# Altium schematic sheet MainADC.SchDoc
size A4
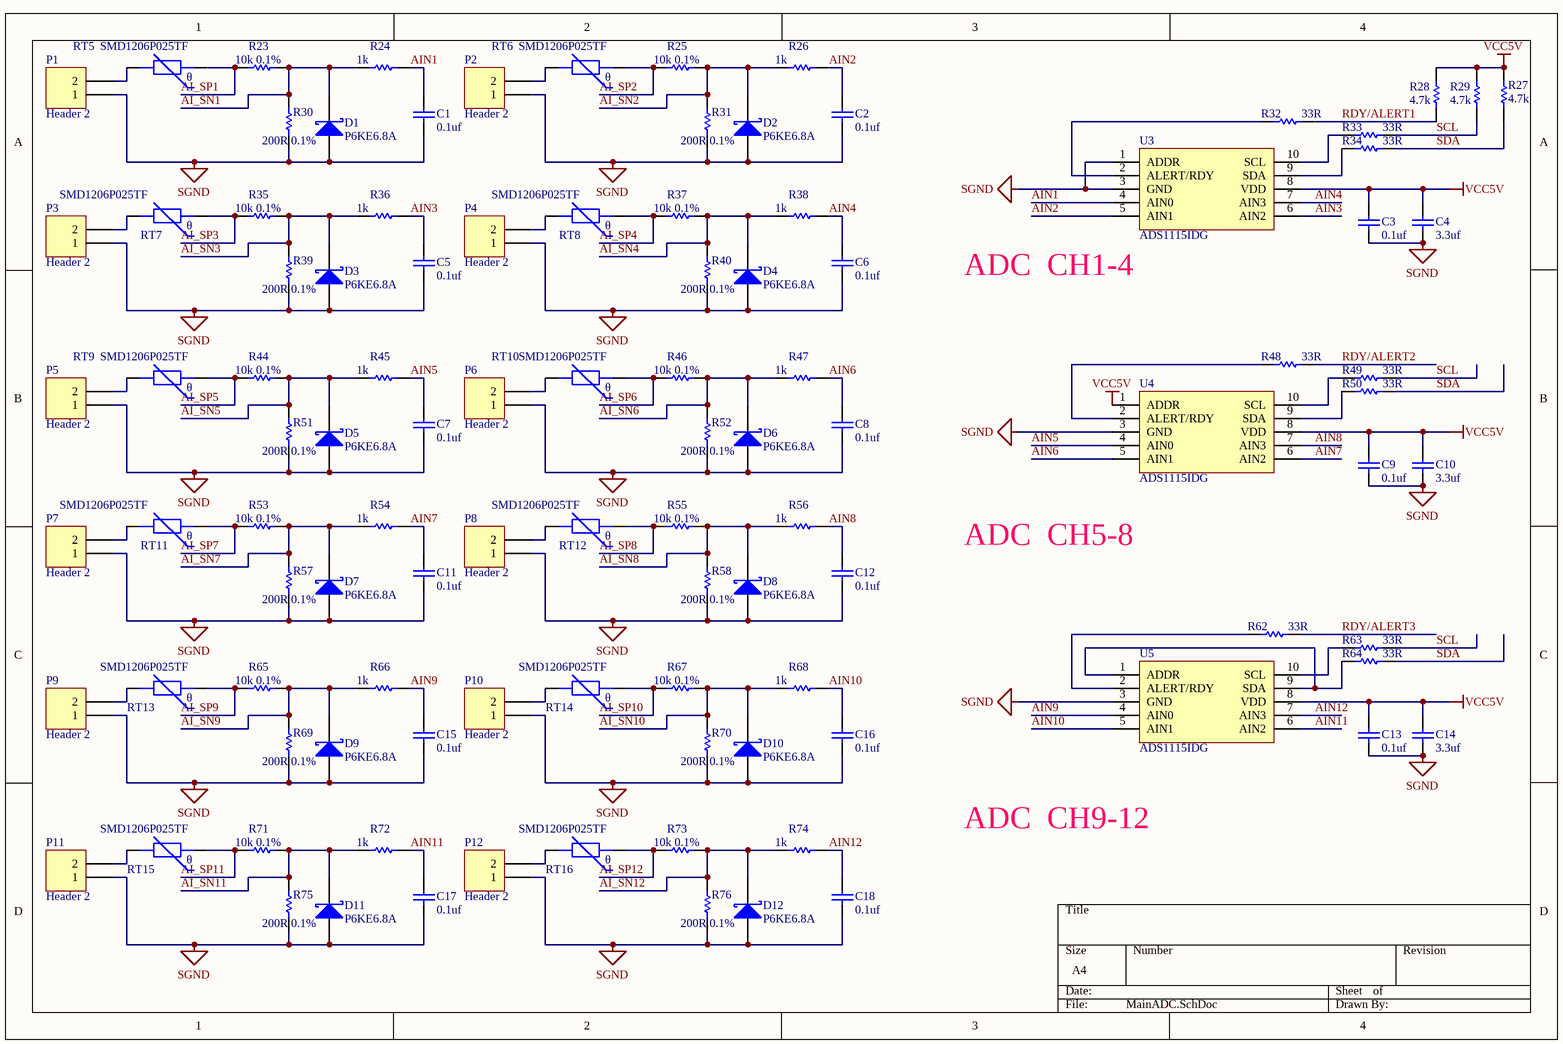
[diagram p0: MainADC.SchDoc]

## Parts
C1  value 0.1uf  [C0805]  (hidden comment: Cap)
C2  value 0.1uf  [C0805]  (hidden comment: Cap)
C3  value 0.1uf  [C0805]  (hidden comment: Cap)
C4  value 3.3uf  [C0805]  (hidden comment: Cap)
C5  value 0.1uf  [C0805]  (hidden comment: Cap)
C6  value 0.1uf  [C0805]  (hidden comment: Cap)
C7  value 0.1uf  [C0805]  (hidden comment: Cap)
C8  value 0.1uf  [C0805]  (hidden comment: Cap)
C9  value 0.1uf  [C0805]  (hidden comment: Cap)
C10  value 3.3uf  [C0805]  (hidden comment: Cap)
C11  value 0.1uf  [C0805]  (hidden comment: Cap)
C12  value 0.1uf  [C0805]  (hidden comment: Cap)
C13  value 0.1uf  [C0805]  (hidden comment: Cap)
C14  value 3.3uf  [C0805]  (hidden comment: Cap)
C15  value 0.1uf  [C0805]  (hidden comment: Cap)
C16  value 0.1uf  [C0805]  (hidden comment: Cap)
C17  value 0.1uf  [C0805]  (hidden comment: Cap)
C18  value 0.1uf  [C0805]  (hidden comment: Cap)
D1  P6KE6.8A  [SMB]
D2  P6KE6.8A  [SMB]
D3  P6KE6.8A  [SMB]
D4  P6KE6.8A  [SMB]
D5  P6KE6.8A  [SMB]
D6  P6KE6.8A  [SMB]
D7  P6KE6.8A  [SMB]
D8  P6KE6.8A  [SMB]
D9  P6KE6.8A  [SMB]
D10  P6KE6.8A  [SMB]
D11  P6KE6.8A  [SMB]
D12  P6KE6.8A  [SMB]
P1  Header 2  [JIEKE_2PX508]
P2  Header 2  [JIEKE_2PX508]
P3  Header 2  [JIEKE_2PX508]
P4  Header 2  [JIEKE_2PX508]
P5  Header 2  [JIEKE_2PX508]
P6  Header 2  [JIEKE_2PX508]
P7  Header 2  [JIEKE_2PX508]
P8  Header 2  [JIEKE_2PX508]
P9  Header 2  [JIEKE_2PX508]
P10  Header 2  [JIEKE_2PX508]
P11  Header 2  [JIEKE_2PX508]
P12  Header 2  [JIEKE_2PX508]
R23  value 10k 0.1%  [0805]  (hidden comment: Res Semi)
R24  value 1k  [0805]  (hidden comment: Res Semi)
R25  value 10k 0.1%  [0805]  (hidden comment: Res Semi)
R26  value 1k  [0805]  (hidden comment: Res Semi)
R27  value 4.7k  [0805]  (hidden comment: Res Semi)
R28  value 4.7k  [0805]  (hidden comment: Res Semi)
R29  value 4.7k  [0805]  (hidden comment: Res Semi)
R30  value 200R 0.1%  [0805]  (hidden comment: Res Semi)
R31  value 200R 0.1%  [0805]  (hidden comment: Res Semi)
R32  value 33R  [0805]  (hidden comment: Res Semi)
R33  value 33R  [0805]  (hidden comment: Res Semi)
R34  value 33R  [0805]  (hidden comment: Res Semi)
R35  value 10k 0.1%  [0805]  (hidden comment: Res Semi)
R36  value 1k  [0805]  (hidden comment: Res Semi)
R37  value 10k 0.1%  [0805]  (hidden comment: Res Semi)
R38  value 1k  [0805]  (hidden comment: Res Semi)
R39  value 200R 0.1%  [0805]  (hidden comment: Res Semi)
R40  value 200R 0.1%  [0805]  (hidden comment: Res Semi)
R44  value 10k 0.1%  [0805]  (hidden comment: Res Semi)
R45  value 1k  [0805]  (hidden comment: Res Semi)
R46  value 10k 0.1%  [0805]  (hidden comment: Res Semi)
R47  value 1k  [0805]  (hidden comment: Res Semi)
R48  value 33R  [0805]  (hidden comment: Res Semi)
R49  value 33R  [0805]  (hidden comment: Res Semi)
R50  value 33R  [0805]  (hidden comment: Res Semi)
R51  value 200R 0.1%  [0805]  (hidden comment: Res Semi)
R52  value 200R 0.1%  [0805]  (hidden comment: Res Semi)
R53  value 10k 0.1%  [0805]  (hidden comment: Res Semi)
R54  value 1k  [0805]  (hidden comment: Res Semi)
R55  value 10k 0.1%  [0805]  (hidden comment: Res Semi)
R56  value 1k  [0805]  (hidden comment: Res Semi)
R57  value 200R 0.1%  [0805]  (hidden comment: Res Semi)
R58  value 200R 0.1%  [0805]  (hidden comment: Res Semi)
R62  value 33R  [0805]  (hidden comment: Res Semi)
R63  value 33R  [0805]  (hidden comment: Res Semi)
R64  value 33R  [0805]  (hidden comment: Res Semi)
R65  value 10k 0.1%  [0805]  (hidden comment: Res Semi)
R66  value 1k  [0805]  (hidden comment: Res Semi)
R67  value 10k 0.1%  [0805]  (hidden comment: Res Semi)
R68  value 1k  [0805]  (hidden comment: Res Semi)
R69  value 200R 0.1%  [0805]  (hidden comment: Res Semi)
R70  value 200R 0.1%  [0805]  (hidden comment: Res Semi)
R71  value 10k 0.1%  [0805]  (hidden comment: Res Semi)
R72  value 1k  [0805]  (hidden comment: Res Semi)
R73  value 10k 0.1%  [0805]  (hidden comment: Res Semi)
R74  value 1k  [0805]  (hidden comment: Res Semi)
R75  value 200R 0.1%  [0805]  (hidden comment: Res Semi)
R76  value 200R 0.1%  [0805]  (hidden comment: Res Semi)
RT5  SMD1206P025TF  [1206]
RT6  SMD1206P025TF  [1206]
RT7  SMD1206P025TF  [1206]
RT8  SMD1206P025TF  [1206]
RT9  SMD1206P025TF  [1206]
RT10  SMD1206P025TF  [1206]
RT11  SMD1206P025TF  [1206]
RT12  SMD1206P025TF  [1206]
RT13  SMD1206P025TF  [1206]
RT14  SMD1206P025TF  [1206]
RT15  SMD1206P025TF  [1206]
RT16  SMD1206P025TF  [1206]
U3  ADS1115IDG  [10uSOP_M]
U4  ADS1115IDG  [10uSOP_M]
U5  ADS1115IDG  [10uSOP_M]

## Nets
SGND: C1.2 C2.2 C3.2 C4.2 C5.2 C6.2 C7.2 C8.2 C9.2 C10.2 C11.2 C12.2 C13.2 C14.2 C15.2 C16.2 C17.2 C18.2 D1.1(A) D2.1(A) D3.1(A) D4.1(A) D5.1(A) D6.1(A) D7.1(A) D8.1(A) D9.1(A) D10.1(A) D11.1(A) D12.1(A) P1.1 P2.1 P3.1 P4.1 P5.1 P6.1 P7.1 P8.1 P9.1 P10.1 P11.1 P12.1 R30.2 R31.2 R39.2 R40.2 R51.2 R52.2 R57.2 R58.2 R69.2 R70.2 R75.2 R76.2 U3.1(ADDR) U3.3(GND) U4.3(GND) U5.3(GND)
VCC5V: C3.1 C4.1 C9.1 C10.1 C13.1 C14.1 R27.1 R28.1 R29.1 U3.8(VDD) U4.1(ADDR) U4.8(VDD) U5.8(VDD)
AI_SN1: D1.2(K) R23.1 R24.2 R30.1
AI_SN2: D2.2(K) R25.1 R26.2 R31.1
AI_SN3: D3.2(K) R35.1 R36.2 R39.1
AI_SN4: D4.2(K) R37.1 R38.2 R40.1
AI_SN5: D5.2(K) R44.1 R45.2 R51.1
AI_SN6: D6.2(K) R46.1 R47.2 R52.1
AI_SN7: D7.2(K) R53.1 R54.2 R57.1
AI_SN8: D8.2(K) R55.1 R56.2 R58.1
AI_SN9: D9.2(K) R65.1 R66.2 R69.1
AI_SN10: D10.2(K) R67.1 R68.2 R70.1
AI_SN11: D11.2(K) R71.1 R72.2 R75.1
AI_SN12: D12.2(K) R73.1 R74.2 R76.1
AI_SP1: R23.2 RT5.2
AI_SP2: R25.2 RT6.2
AI_SP3: R35.2 RT7.2
AI_SP4: R37.2 RT8.2
AI_SP5: R44.2 RT9.2
AI_SP6: R46.2 RT10.2
AI_SP7: R53.2 RT11.2
AI_SP8: R55.2 RT12.2
AI_SP9: R65.2 RT13.2
AI_SP10: R67.2 RT14.2
AI_SP11: R71.2 RT15.2
AI_SP12: R73.2 RT16.2
AIN1: C1.1 R24.1 U3.4(AIN0)
AIN2: C2.1 R26.1 U3.5(AIN1)
AIN3: C5.1 R36.1 U3.6(AIN2)
AIN4: C6.1 R38.1 U3.7(AIN3)
AIN5: C7.1 R45.1 U4.4(AIN0)
AIN6: C8.1 R47.1 U4.5(AIN1)
AIN7: C11.1 R54.1 U4.6(AIN2)
AIN8: C12.1 R56.1 U4.7(AIN3)
AIN9: C15.1 R66.1 U5.4(AIN0)
AIN10: C16.1 R68.1 U5.5(AIN1)
AIN11: C17.1 R72.1 U5.6(AIN2)
AIN12: C18.1 R74.1 U5.7(AIN3)
RDY/ALERT1: R28.2 R32.1
RDY/ALERT2: R48.1
RDY/ALERT3: R62.1
SCL: R29.2 R33.1 R49.1 R63.1
SDA: R27.2 R34.1 R50.1 R64.1
NetP1_2: P1.2 RT5.1
NetP2_2: P2.2 RT6.1
NetP3_2: P3.2 RT7.1
NetP4_2: P4.2 RT8.1
NetP5_2: P5.2 RT9.1
NetP6_2: P6.2 RT10.1
NetP7_2: P7.2 RT11.1
NetP8_2: P8.2 RT12.1
NetP9_2: P9.2 RT13.1
NetP10_2: P10.2 RT14.1
NetP11_2: P11.2 RT15.1
NetP12_2: P12.2 RT16.1
NetR32_2: R32.2 U3.2(ALERT/RDY)
NetR33_2: R33.2 U3.10(SCL)
NetR34_2: R34.2 U3.9(SDA)
NetR48_2: R48.2 U4.2(ALERT/RDY)
NetR49_2: R49.2 U4.10(SCL)
NetR50_2: R50.2 U4.9(SDA)
NetR62_2: R62.2 U5.2(ALERT/RDY)
NetR63_2: R63.2 U5.10(SCL)
NetR64_2: R64.2 U5.1(ADDR) U5.9(SDA)

## Notes on the sheet
- (near U3) ADC  CH1-4
- ADC  CH5-8
- ADC  CH9-12
- (in symbol PTC) θ

## Library data of the parts
C1-C18 = Cap: Capacitor; Manufacturer: Generic Components; Class: Passive; Published: 08/06/2000; Publisher: Altium Hobart Technology Centre; SubClass: Capacitor
D1-D12 = D Schottky: Schottky Diode; Published: 8-Jun-2000; LatestRevisionDate: 17-Jul-2002; LatestRevisionNote: Re-released for DXP Platform.; PackageReference: SMB; Publisher: Altium Limited; Code_JEDEC: DO-214-AA
P1-P12 = Header 2: Header, 2-Pin; LatestRevisionDate: 17-Jul-2002; LatestRevisionNote: Re-released for DXP Platform.; Publisher: Altium Limited
R23-R40 R44-R58 R62-R76 = Res Semi: Semiconductor Resistor; Published: 8-Jun-2000; LatestRevisionDate: 17-Jul-2002; LatestRevisionNote: Re-released for DXP Platform.; PackageReference: AXIAL-0.5; Publisher: Altium Limited
RT5-RT16 = PTC: 热敏电阻
U3-U5 = ADS